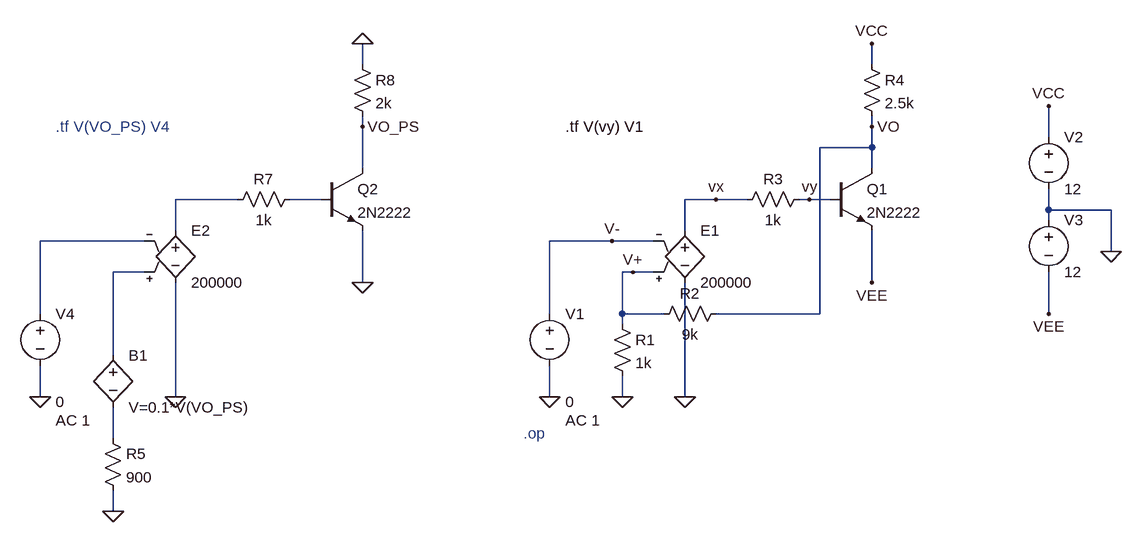
[diagram p0: schematic eje1_p1_2026.asc]
eje1_p1_2026.asc, the LTspice schematic file:
Version 4.1
SHEET 1 964 1232
WIRE -208 -128 -208 -160
WIRE 576 -128 576 -160
WIRE -208 -32 -208 -48
WIRE 576 -32 576 -48
WIRE 848 -16 848 -64
WIRE 576 0 576 -32
WIRE 576 0 496 0
WIRE -208 32 -208 -32
WIRE 576 32 576 0
WIRE -400 80 -496 80
WIRE -272 80 -320 80
WIRE 336 80 288 80
WIRE 384 80 336 80
WIRE 480 80 464 80
WIRE 512 80 480 80
WIRE 848 96 848 64
WIRE 944 96 848 96
WIRE 848 112 848 96
WIRE -496 128 -496 80
WIRE 288 128 288 80
WIRE -544 144 -704 144
WIRE 176 144 80 144
WIRE 240 144 176 144
WIRE 944 160 944 96
WIRE -544 192 -592 192
WIRE 208 192 192 192
WIRE 240 192 208 192
WIRE -208 208 -208 128
WIRE 576 208 576 128
WIRE -704 256 -704 144
WIRE 80 256 80 144
WIRE 192 256 192 192
WIRE 256 256 192 256
WIRE 496 256 496 0
WIRE 496 256 336 256
WIRE 848 256 848 192
WIRE 192 272 192 256
WIRE -592 320 -592 192
WIRE -704 384 -704 336
WIRE -496 384 -496 208
WIRE 80 384 80 336
WIRE 192 384 192 352
WIRE 288 384 288 208
WIRE -592 448 -592 400
WIRE -592 560 -592 528
FLAG 80 384 0
FLAG 192 384 0
FLAG 288 384 0
FLAG 848 -64 VCC
FLAG 848 256 VEE
FLAG 944 160 0
FLAG 576 208 VEE
FLAG 576 -160 VCC
FLAG 576 -32 VO
FLAG 336 80 vx
FLAG 176 144 V-
FLAG 208 192 V+
FLAG -704 384 0
FLAG -592 560 0
FLAG -496 384 0
FLAG -208 208 0
FLAG -208 -160 0
FLAG -208 -32 VO_PS
FLAG 480 80 vy
SYMBOL e2 288 112 R0
SYMATTR InstName E1
SYMATTR Value 200000
SYMBOL voltage 80 240 R0
WINDOW 3 24 152 Left 2
WINDOW 123 24 180 Left 2
WINDOW 39 0 0 Left 0
SYMATTR Value 0
SYMATTR Value2 AC 1
SYMATTR InstName V1
SYMBOL res 176 256 R0
SYMATTR InstName R1
SYMATTR Value 1k
SYMBOL res 352 240 R90
WINDOW 0 0 56 VBottom 2
WINDOW 3 32 56 VTop 2
SYMATTR InstName R2
SYMATTR Value 9k
SYMBOL res 480 64 R90
WINDOW 0 0 56 VBottom 2
WINDOW 3 32 56 VTop 2
SYMATTR InstName R3
SYMATTR Value 1k
SYMBOL npn 512 32 R0
SYMATTR InstName Q1
SYMATTR Value 2N2222
SYMBOL voltage 848 -32 R0
WINDOW 123 0 0 Left 0
WINDOW 39 0 0 Left 0
SYMATTR InstName V2
SYMATTR Value 12
SYMBOL voltage 848 96 R0
WINDOW 123 0 0 Left 0
WINDOW 39 0 0 Left 0
SYMATTR InstName V3
SYMATTR Value 12
SYMBOL res 560 -144 R0
SYMATTR InstName R4
SYMATTR Value 2.5k
SYMBOL e2 -496 112 R0
SYMATTR InstName E2
SYMATTR Value 200000
SYMBOL voltage -704 240 R0
WINDOW 3 24 152 Left 2
WINDOW 123 24 180 Left 2
WINDOW 39 0 0 Left 0
SYMATTR Value 0
SYMATTR Value2 AC 1
SYMATTR InstName V4
SYMBOL res -608 432 R0
SYMATTR InstName R5
SYMATTR Value 900
SYMBOL res -304 64 R90
WINDOW 0 0 56 VBottom 2
WINDOW 3 32 56 VTop 2
SYMATTR InstName R7
SYMATTR Value 1k
SYMBOL npn -272 32 R0
SYMATTR InstName Q2
SYMATTR Value 2N2222
SYMBOL res -224 -144 R0
SYMATTR InstName R8
SYMATTR Value 2k
SYMBOL bv -592 304 R0
SYMATTR InstName B1
SYMATTR Value V=0.1*V(VO_PS)
TEXT 104 -32 Left 2 !.tf V(vy) V1
TEXT 40 440 Left 2 ;.op
TEXT -680 -32 Left 2 ;.tf V(VO_PS) V4

The netlist it stands for:
* eje1_p1_2026.asc
E1 vx 0 V+ V- 200000
V1 V- 0 0 AC 1
R1 V+ 0 1k
R2 VO V+ 9k
R3 vy vx 1k
Q1 VO vy VEE 0 2N2222
V2 VCC 0 12
V3 0 VEE 12
R4 VCC VO 2.5k
E2 N001 0 N004 N003 200000
V4 N003 0 0 AC 1
R5 N005 0 900
R7 N002 N001 1k
Q2 VO_PS N002 0 0 2N2222
R8 0 VO_PS 2k
B1 N004 N005 V=0.1*V(VO_PS)
.model NPN NPN
.model PNP PNP
.lib standard.bjt
.tf V(vy) V1
* .op
* .tf V(VO_PS) V4
.backanno
.end